# Altium schematic sheet SSR.SchDoc
size C; SheetNumber: 7; SheetTotal: 15
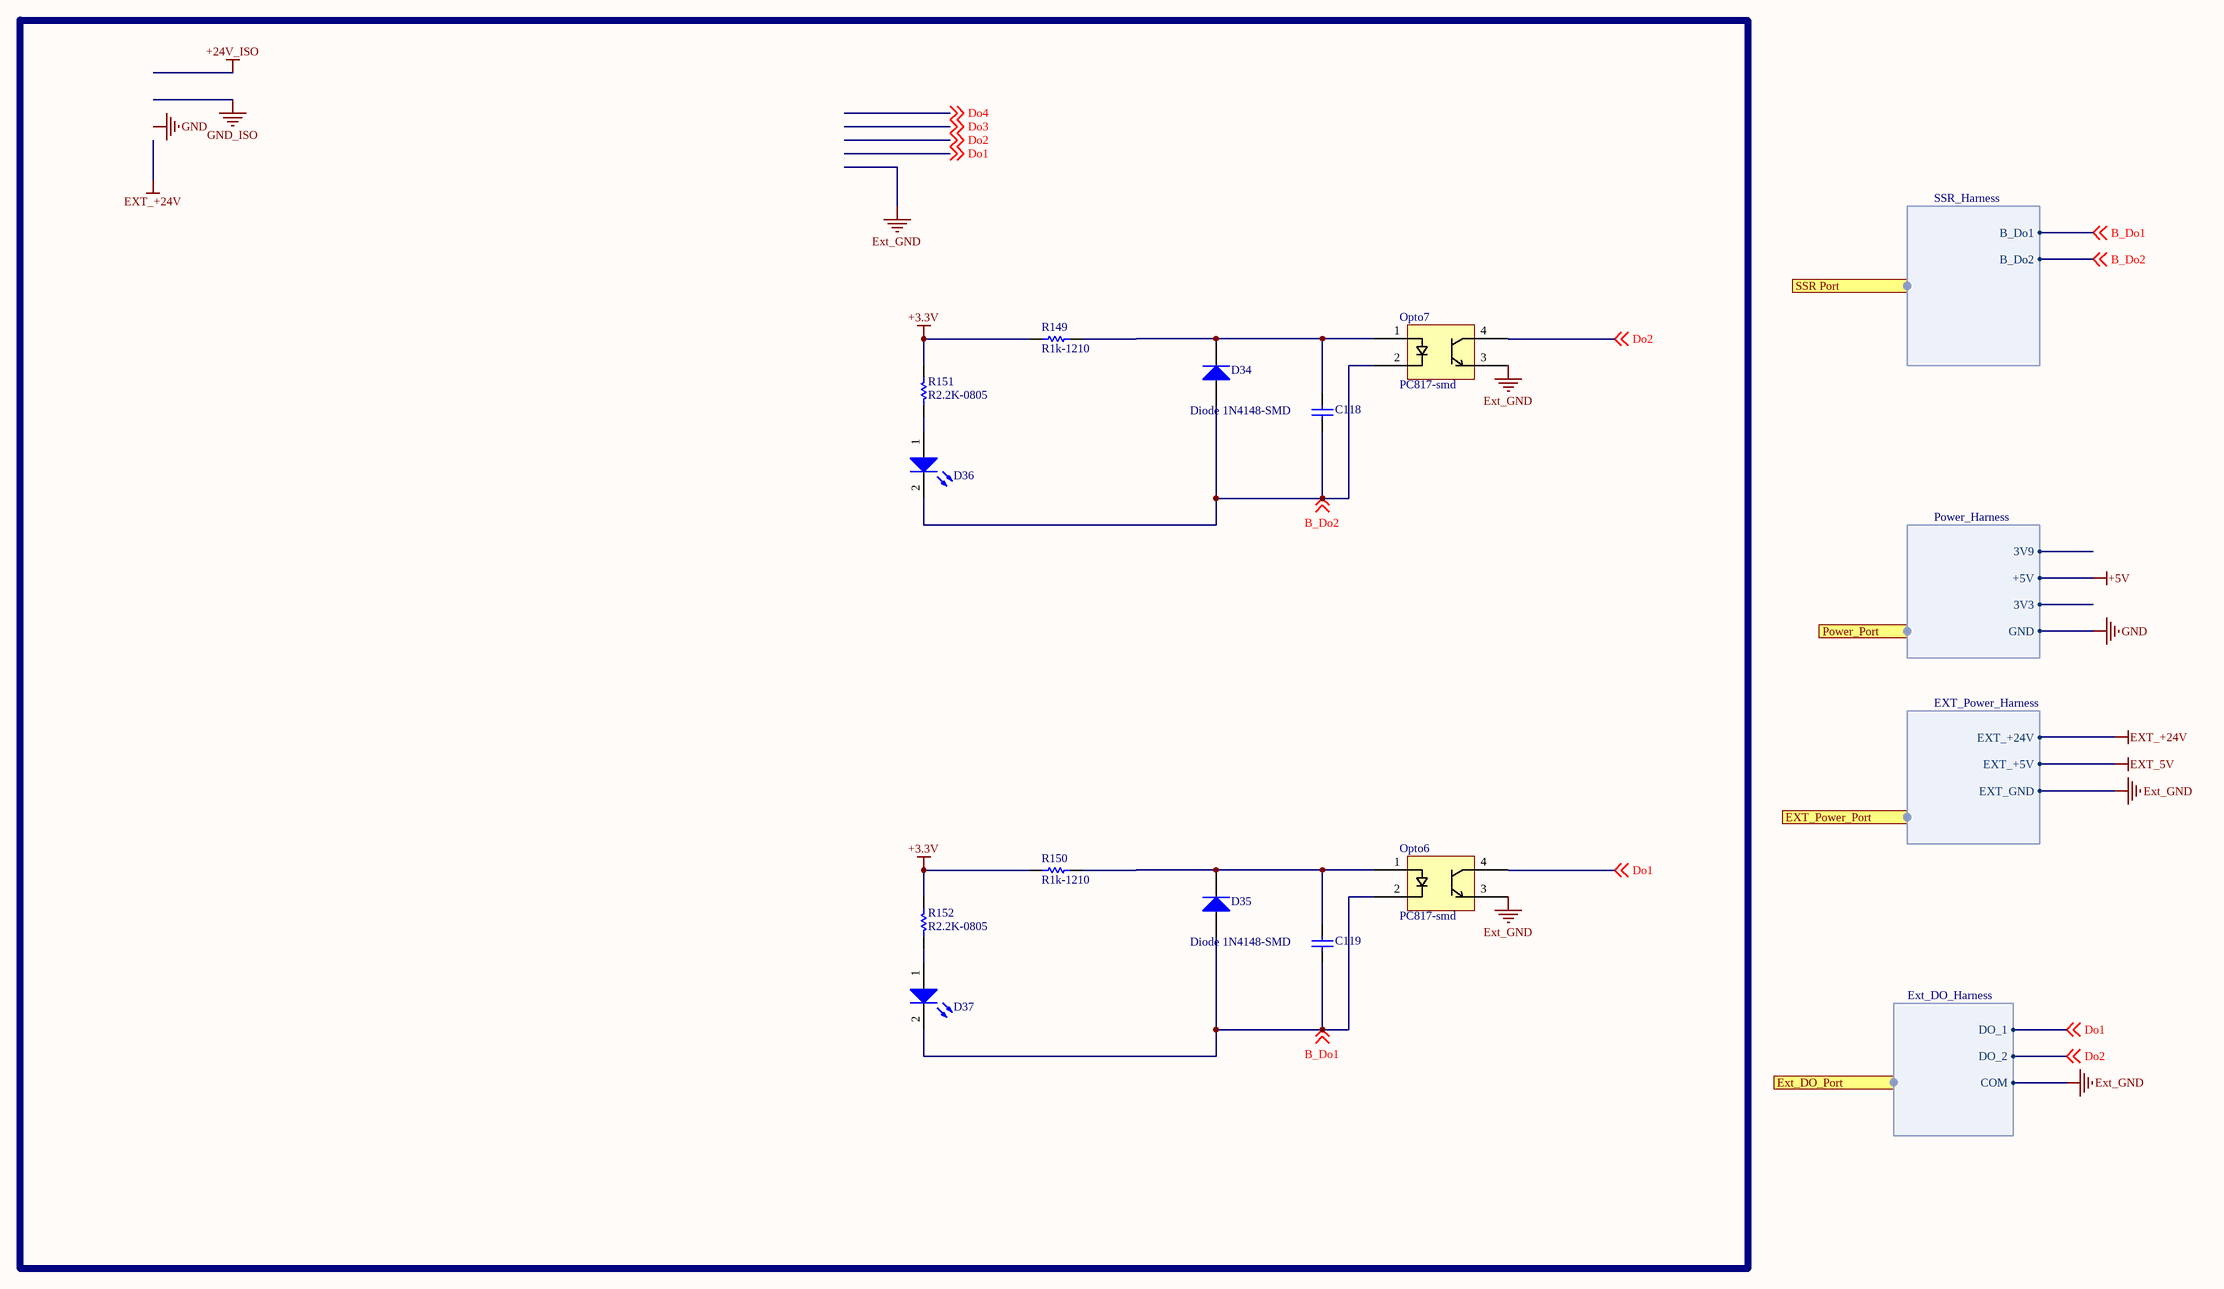
[diagram p0: SSR.SchDoc]

## Parts
C118  (no value)  [CRF06031]
C119  (no value)  [CRF06031]
D34  Diode 1N4148-SMD  [d1206]
D35  Diode 1N4148-SMD  [d1206]
D36  LED_0805_green  [0805-LED]  (value not drawn)
D37  LED_0805_green  [0805-LED]  (value not drawn)
Opto6  PC817-smd  [PC817_SMD1]
Opto7  PC817-smd  [PC817_SMD1]
R149  R1k-1210  [r1210]
R150  R1k-1210  [r1210]
R151  R2.2K-0805  [CRF06031]
R152  R2.2K-0805  [CRF06031]

## Ports
Ext_DO_Port (harness Ext_DO_Harness), EXT_Power_Port (harness EXT_Power_Harness), Power_Port (harness Power_Harness), SSR Port (harness SSR_Harness)

## Harnesses
SSR_Harness: B_Do1, B_Do2
Power_Harness: 3V9, +5V, 3V3, GND
EXT_Power_Harness: EXT_+24V, EXT_+5V, EXT_GND
Ext_DO_Harness: DO_1, DO_2, COM

## Nets
+3.3V: R149.1 R150.1 R151.2 R152.2
+5V: port Power_Port.+5V
EXT_5V: port EXT_Power_Port.EXT_+5V
EXT_+24V: port EXT_Power_Port.EXT_+24V
Ext_GND: Opto6.3 Opto7.3 ; port EXT_Power_Port.EXT_GND, port Ext_DO_Port.COM
GND: port Power_Port.GND
B_Do1: C119.1 D35.1(A) D37.2(K) Opto6.2 ; off-sheet B_Do1, port SSR Port.B_Do1
B_Do2: C118.1 D34.1(A) D36.2(K) Opto7.2 ; off-sheet B_Do2, port SSR Port.B_Do2
Do1: Opto6.4 ; off-sheet Do1, port Ext_DO_Port.DO_1
Do2: Opto7.4 ; off-sheet Do2, port Ext_DO_Port.DO_2
NetC118_2: C118.2 D34.2(K) Opto7.1 R149.2
NetC119_2: C119.2 D35.2(K) Opto6.1 R150.2
NetD36_1: D36.1(A) R151.1
NetD37_1: D37.1(A) R152.1

## Notes on the sheet
- Labels drawn without touching a wire or pin: GND

## Library data of the parts
C118 C119 = Cap: Capacitor; Manufacturer_P/N: GCM21BR72A104KA37L; Digi-Key_Part_Number: 490-4789-1-ND; JLC P/N: C85866
D34 D35 = Diode 1N4934: 1 Amp Fast Recovery Rectifier; Manufacturer_P/N: 1N4148WS; Digi-Key_Part_Number: 1N4148WSFSTR-ND; JLC P/N: C2128
D36 D37 = LED_0805: Manufacturer_P/N: NCD0805R1; JLC P/N: C84256
Opto6 Opto7 = PC817: Manufacturer_P/N: APC-817D1-SL; Digi-Key_Part_Number: 2007-APC-817D1-SLTR-ND; JLC P/N: C17448553
R149 R150 = Res1: Resistor; Manufacturer_P/N: RC1210FR-071KL; Digi-Key_Part_Number: YAG2296TR-ND; JLC P/N: C83144
R151 R152 = Res1: Resistor; Manufacturer_P/N: RC0805FR-072K2L; Digi-Key_Part_Number: 311-2.20KCRTR-ND; JLC P/N: C114561